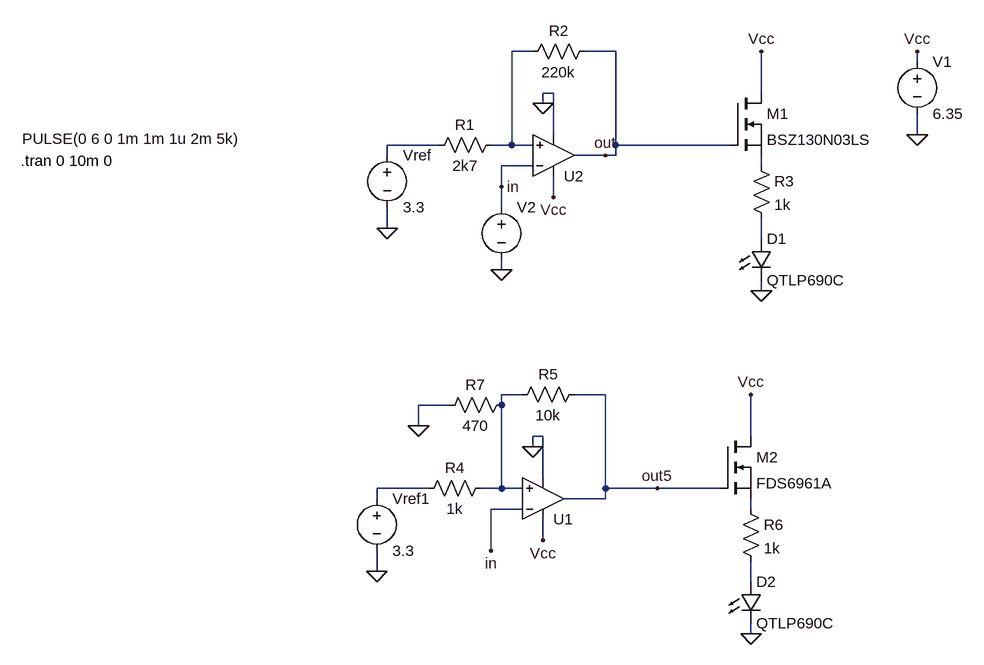
[diagram p0: schematic triangular.asc]
triangular.asc, the LTspice schematic file:
Version 4
SHEET 1 1056 708
WIRE 384 -208 352 -208
WIRE 512 -208 464 -208
WIRE 976 -192 976 -208
WIRE 416 -144 400 -144
WIRE 736 -144 736 -208
WIRE 400 -128 400 -144
WIRE 416 -80 416 -144
WIRE 976 -80 976 -112
WIRE 240 -64 160 -64
WIRE 352 -64 352 -208
WIRE 352 -64 320 -64
WIRE 384 -64 352 -64
WIRE 512 -64 512 -208
WIRE 688 -64 512 -64
WIRE 160 -48 160 -64
WIRE 496 -48 448 -48
WIRE 512 -48 512 -64
WIRE 512 -48 496 -48
WIRE 384 -32 336 -32
WIRE 736 -32 736 -48
WIRE 336 0 336 -32
WIRE 416 16 416 -16
WIRE 336 32 336 0
WIRE 160 64 160 32
WIRE 736 80 736 48
WIRE 336 128 336 112
WIRE 736 160 736 144
WIRE 368 320 336 320
WIRE 496 320 448 320
WIRE 256 336 208 336
WIRE 336 336 336 320
WIRE 208 368 208 336
WIRE 400 384 384 384
WIRE 720 384 720 320
WIRE 384 400 384 384
WIRE 400 448 400 384
WIRE 224 464 144 464
WIRE 336 464 336 336
WIRE 336 464 304 464
WIRE 368 464 336 464
WIRE 496 464 496 320
WIRE 576 464 496 464
WIRE 672 464 576 464
WIRE 144 480 144 464
WIRE 496 480 496 464
WIRE 496 480 432 480
WIRE 368 496 320 496
WIRE 720 496 720 480
WIRE 400 544 400 512
WIRE 320 560 320 496
WIRE 144 592 144 560
WIRE 720 608 720 576
WIRE 720 688 720 672
FLAG 336 128 0
FLAG 976 -208 Vcc
FLAG 416 16 Vcc
FLAG 160 64 0
FLAG 496 -48 out
FLAG 336 0 in
FLAG 400 -128 0
FLAG 976 -80 0
FLAG 736 160 0
FLAG 736 -208 Vcc
FLAG 400 544 Vcc
FLAG 144 592 0
FLAG 384 400 0
FLAG 720 688 0
FLAG 720 320 Vcc
FLAG 320 560 in
FLAG 576 464 out5
FLAG 208 368 0
SYMBOL OpAmps\\UniversalOpamp2 416 -48 M180
SYMATTR InstName U2
SYMBOL res 336 -80 R90
WINDOW 0 0 56 VBottom 2
WINDOW 3 32 56 VTop 2
SYMATTR InstName R1
SYMATTR Value 2k7
SYMBOL res 480 -224 R90
WINDOW 0 0 56 VBottom 2
WINDOW 3 32 56 VTop 2
SYMATTR InstName R2
SYMATTR Value 220k
SYMBOL voltage 976 -208 R0
WINDOW 123 0 0 Left 0
WINDOW 39 0 0 Left 0
SYMATTR InstName V1
SYMATTR Value 6.35
SYMBOL voltage 336 16 R0
WINDOW 3 -738 -90 Left 2
WINDOW 123 0 0 Left 0
WINDOW 39 0 0 Left 0
SYMATTR InstName V2
SYMATTR Value PULSE(0 6 0 1m 1m 1u 2m 5k)
SYMBOL voltage 160 -64 R0
WINDOW 123 0 0 Left 0
WINDOW 39 0 0 Left 0
SYMATTR InstName Vref
SYMATTR Value 3.3
SYMBOL LED 720 80 R0
SYMATTR InstName D1
SYMATTR Value QTLP690C
SYMATTR Description Diode
SYMATTR Type diode
SYMBOL res 720 -48 R0
SYMATTR InstName R3
SYMATTR Value 1k
SYMBOL nmos 688 -144 R0
SYMATTR InstName M1
SYMATTR Value BSZ130N03LS
SYMBOL OpAmps\\UniversalOpamp2 400 480 M180
SYMATTR InstName U1
SYMBOL res 320 448 R90
WINDOW 0 0 56 VBottom 2
WINDOW 3 32 56 VTop 2
SYMATTR InstName R4
SYMATTR Value 1k
SYMBOL res 464 304 R90
WINDOW 0 0 56 VBottom 2
WINDOW 3 32 56 VTop 2
SYMATTR InstName R5
SYMATTR Value 10k
SYMBOL voltage 144 464 R0
WINDOW 123 0 0 Left 0
WINDOW 39 0 0 Left 0
SYMATTR InstName Vref1
SYMATTR Value 3.3
SYMBOL LED 704 608 R0
SYMATTR InstName D2
SYMATTR Value QTLP690C
SYMATTR Description Diode
SYMATTR Type diode
SYMBOL res 704 480 R0
SYMATTR InstName R6
SYMATTR Value 1k
SYMBOL nmos 672 384 R0
SYMATTR InstName M2
SYMATTR Value FDS6961A
SYMBOL res 352 320 R90
WINDOW 0 0 56 VBottom 2
WINDOW 3 32 56 VTop 2
SYMATTR InstName R7
SYMATTR Value 470
TEXT -404 -40 Left 2 !.tran 0 10m 0

The netlist it stands for:
* triangular.asc
XU2 N001 in Vcc 0 out level.2 Avol=1Meg GBW=10Meg Slew=10Meg ilimit=25m rail=0 Vos=0 phimargin=45 en=0 enk=0 in=0 ink=0 Rin=500Meg  ; pins IN+ IN- V+ V- OUT
R1 N001 N002 2k7
R2 out N001 220k
V1 Vcc 0 6.35
V2 in 0 PULSE(0 6 0 1m 1m 1u 2m 5k)
Vref N002 0 3.3
D1 N004 0 QTLP690C
R3 N003 N004 1k
M1 Vcc out N003 N003 BSZ130N03LS
XU1 N005 in Vcc 0 out5 level.2 Avol=1Meg GBW=10Meg Slew=10Meg ilimit=25m rail=0 Vos=0 phimargin=45 en=0 enk=0 in=0 ink=0 Rin=500Meg  ; pins IN+ IN- V+ V- OUT
R4 N005 N006 1k
R5 out5 N005 10k
Vref1 N006 0 3.3
D2 N008 0 QTLP690C
R6 N007 N008 1k
M2 Vcc out5 N007 N007 FDS6961A
R7 N005 0 470
.model D D
.lib standard.dio
.model NMOS NMOS
.model PMOS PMOS
.lib standard.mos
.tran 0 10m 0
.lib UniversalOpamps2.sub
.backanno
.end